# EAGLE design Ramps_Driver_LED_Tester (EAGLE 7.3.0)
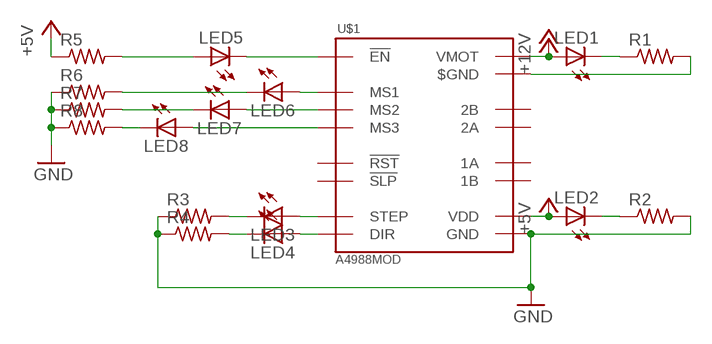
[diagram p0: schematic, sheet 1]

## Parts
LED1  LEDCHIPLED_0805  [CHIPLED_0805]
LED2  LEDCHIPLED_0805  [CHIPLED_0805]
LED3  LEDCHIPLED_0805  [CHIPLED_0805]
LED4  LEDCHIPLED_0805  [CHIPLED_0805]
LED5  LEDCHIPLED_0805  [CHIPLED_0805]
LED6  LEDCHIPLED_0805  [CHIPLED_0805]
LED7  LEDCHIPLED_0805  [CHIPLED_0805]
LED8  LEDCHIPLED_0805  [CHIPLED_0805]
R1  R-US_R0805  [R0805]
R2  R-US_R0805  [R0805]
R3  R-US_R0805  [R0805]
R4  R-US_R0805  [R0805]
R5  R-US_R0805  [R0805]
R6  R-US_R0805  [R0805]
R7  R-US_R0805  [R0805]
R8  R-US_R0805  [R0805]
U$1  A4988MOD  [A4988MOD]

## Nets
+5V: LED2.A R5.1 U$1.P$10(VDD)
+12V: LED1.A U$1.P$16(VMOT)
GND: R2.2 R3.1 R4.1 R6.1 R7.1 R8.1 U$1.P$9(GND)
N$1: LED1.C R1.1
N$4: LED2.C R2.1
N$5: LED3.A U$1.P$7(STEP)
N$6: LED4.A U$1.P$8(DIR)
N$7: LED3.C R3.2
N$8: LED4.C R4.2
N$9: LED5.C U$1.P$1(!EN)
N$10: LED5.A R5.2
N$11: LED6.A U$1.P$2(MS1)
N$12: LED8.A U$1.P$4(MS3)
N$13: LED7.A U$1.P$3(MS2)
N$14: LED6.C R6.2
N$15: LED7.C R7.2
N$16: LED8.C R8.2
N$18: R1.2 U$1.P$15($GND)
Unconnected: U$1.P$5(!RST) U$1.P$6(!SLP) U$1.P$11(1B) U$1.P$12(1A) U$1.P$13(2A) U$1.P$14(2B)

## Library data of the parts
LED1-LED8 = led:LED: LED OSRAM: - CHIPLED LG R971, LG N971, LY N971, LG Q971, LY Q971, LO R971, LY R971 LH N974, LH R974 LS Q976, LO Q976, LY Q976 LO Q996 - Hyper CHIPLED LW Q18S LB Q993, LB Q99A, LB R99A - SideLED LS A670, LO A670, LY A670, LG A670, LP A670 LB A673, LV A673, LT A673, LW A673 LH A674 LY A675 LS A676, LA A676, LO A676, LY A676, LW A676 LS A679, LY A679, LG A679 - Hyper Micro SIDELED® LS Y876, LA Y876, LO Y876, LY Y876 LT Y87S - SmartLED LW L88C, LW L88S LB L89C, LB L89S, LG L890 LS L89K, LO L89K, LY L89K LS L896, LA L896, LO L896, LY L896 - TOPLED LS T670, LO T670, LY T670, LG T670, LP T670 LSG T670, LSP T670, LSY T670, LOP T670, LYG T670 LG T671, LOG T671, LSG T671 LB T673, LV T673, LT T673, LW T673 LH T674 LS T676, LA T676, LO T676, LY T676, LB T676, LH T676, LSB T676, LW T676 LB T67C, LV T67C, LT T67C, LS T67K, LO T67K, LY T67K, LW E67C LS E67B, LA E67B, LO E67B, LY E67B, LB E67C, LV E67C, LT E67C LW T67C LS T679, LY T679, LG T679 LS T770, LO T770, LY T770, LG T770, LP T770 LB T773, LV T773, LT T773, LW T773 LH T774 LS E675, LA E675, LY E675, LS T675 LS T776, LA T776, LO T776, LY T776, LB T776 LHGB T686 LT T68C, LB T68C - Hyper Mini TOPLED® LB M676 - Mini TOPLED Santana® LG M470 LS M47K, LO M47K, LY M47K Source: http://www.osram.convergy.de LUXEON: - LUMILED® LXK2-PW12-R00, LXK2-PW12-S00, LXK2-PW14-U00, LXK2-PW14-V00 LXK2-PM12-R00, LXK2-PM12-S00, LXK2-PM14-U00 LXK2-PE12-Q00, LXK2-PE12-R00, LXK2-PE12-S00, LXK2-PE14-T00, LXK2-PE14-U00 LXK2-PB12-K00, LXK2-PB12-L00, LXK2-PB12-M00, LXK2-PB14-N00, LXK2-PB14-P00, LXK2-PB14-Q00 LXK2-PR12-L00, LXK2-PR12-M00, LXK2-PR14-Q00, LXK2-PR14-R00 LXK2-PD12-Q00, LXK2-PD12-R00, LXK2-PD12-S00 LXK2-PH12-R00, LXK2-PH12-S00 LXK2-PL12-P00, LXK2-PL12-Q00, LXK2-PL12-R00 Source: www.luxeon.com KINGBRIGHT: KA-3528ASYC Source: www.kingbright.com
R1-R8 = resistor:R-US_: RESISTOR, American symbol
U$1 = RobThePyro:A4988MOD

## Board
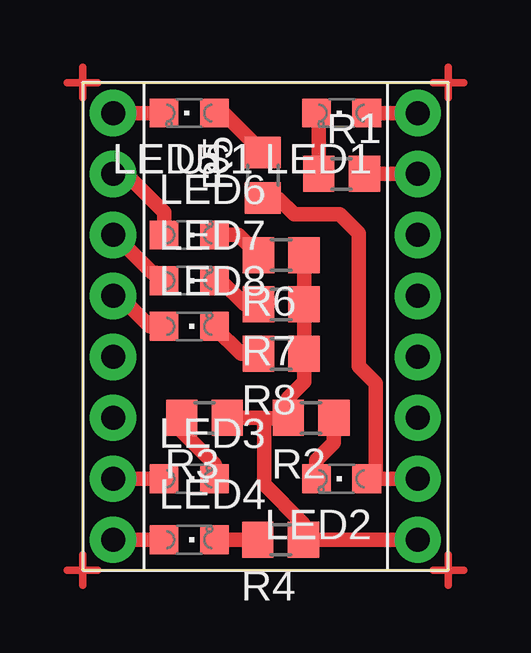
[diagram p1: board, top side]

Size 15.24 x 20.32 mm. Coordinates in mm from the lower left corner, seen from the top.
Outline: 0,0 0,20.32 15.24,20.32 15.24,0 0,0
Copper layers (1*16): Top 0.035mm / dielectric 1.5mm / Bottom 0.035mm
Design rules "default": minimum track width 10mil, minimum drill 24mil, track to track 8mil, track to pad 8mil, pad to pad 8mil, via to via 8mil, smd to smd 8mil, copper to edge 40mil, drill to drill 8mil, minimum pad ring 10mil, minimum via ring 8mil, stop-mask expansion 4mil, vias tented up to drill 0mil, thermal gap 10mil

### Footprints (pad centres in the part's own frame; a part is rotated, then mirrored left to right if it is on the bottom)
CHIPLED_0805 = smd 1.2 x 1.2: A 0,-1.05; C 0,1.05
R0805 = smd 1.3 x 1.5: 1 -0.95,0; 2 0.95,0
A4988MOD = drill 1 pad 1.93: P$1 -6.35,8.89; P$2 -6.35,6.35; P$3 -6.35,3.81; P$4 -6.35,1.27; P$5 -6.35,-1.27; P$6 -6.35,-3.81; P$7 -6.35,-6.35; P$8 -6.35,-8.89; P$9 6.35,-8.89; P$10 6.35,-6.35; P$11 6.35,-3.81; P$12 6.35,-1.27; P$13 6.35,1.27; P$14 6.35,3.81; P$15 6.35,6.35; P$16 6.35,8.89

### Placement (x,y rotation side)
LED1  10.79,19.05 90 top
LED2  10.79,3.81 90 top
LED3  4.45,3.81 270 top
LED4  4.45,1.27 270 top
LED5  4.45,19.05 90 top
LED6  4.45,13.97 270 top
LED7  4.45,12.06 270 top
LED8  4.45,10.16 270 top
R1  10.79,16.51 0 top
R2  9.53,6.35 180 top
R3  5.08,6.35 180 top
R4  8.26,1.27 180 top
R5  7.52,16.46 90 top
R6  8.28,13.13 180 top
R7  8.28,11.07 180 top
R8  8.28,9.02 180 top
U$1  7.62,10.16 0 top

### Tracks (layer width: path | path; a pad name or v marks a point on that pad's centre or on a via)
+5V
  Top 0.61: U$1.P$10 LED2.A 12.22,4.18 12.22,7.8 11.51,8.51 11.51,14.05 10.72,14.83 8.81,14.83 8.14,15.51 R5.1
+12V
  Top 0.61: LED1.A U$1.P$16
GND
  Top 0.61: U$1.P$9 R4.1 9.21,1.95 7.57,3.58 7.57,6.33 | 7.57,6.33 8.55,6.33 R2.2 8.57,7.18 9.25,7.85 9.25,9 R8.1 R7.1 R6.1 | R3.1 7.54,6.35 7.57,6.33
N$1
  Top 0.61: LED1.C 9.85,19.05 R1.1
N$2
  Top 0.305: 0,-0.64 0,0.64
N$3
  Top 0.305: -0.64,0 0.64,0
N$4
  Top 0.61: LED2.C 9.74,4.59 10.46,5.31 R2.1
N$5
  Top 0.61: LED3.A U$1.P$7
N$6
  Top 0.61: LED4.A U$1.P$8
N$7
  Top 0.61: LED3.C 5.51,3.83 5.51,4.42 4.13,5.8 R3.2
N$8
  Top 0.61: LED4.C R4.2
N$9
  Top 0.61: LED5.C U$1.P$1
N$10
  Top 0.61: LED5.A 5.88,19.05 R5.2
N$11
  Top 0.61: U$1.P$2 1.8,16.51 3.4,14.91 LED6.A
N$12
  Top 0.61: U$1.P$4 1.52,11.43 2.79,10.16 LED8.A
N$13
  Top 0.61: U$1.P$3 1.32,13.97 2.9,12.39 3.06,12.39 LED7.A
N$14
  Top 0.61: LED6.C 6.49,13.97 R6.2
N$15
  Top 0.61: LED7.C 5.77,12.06 6.76,11.07 R7.2
N$16
  Top 0.61: LED8.C 5.5,10.13 6.6,9.02 R8.2
N$17
  Top 0.305: 15.88,0 14.61,0
N$18
  Top 0.61: R1.2 U$1.P$15
N$19
  Top 0.305: 15.24,-0.64 15.24,0.64
N$20
  Top 0.305: 15.24,20.95 15.24,19.68
N$21
  Top 0.305: 15.88,20.32 14.61,20.32
N$22
  Top 0.305: 0,20.95 0,19.68
N$23
  Top 0.305: -0.64,20.32 0.64,20.32